# Altium schematic sheet Bop-It.SchDoc
size A
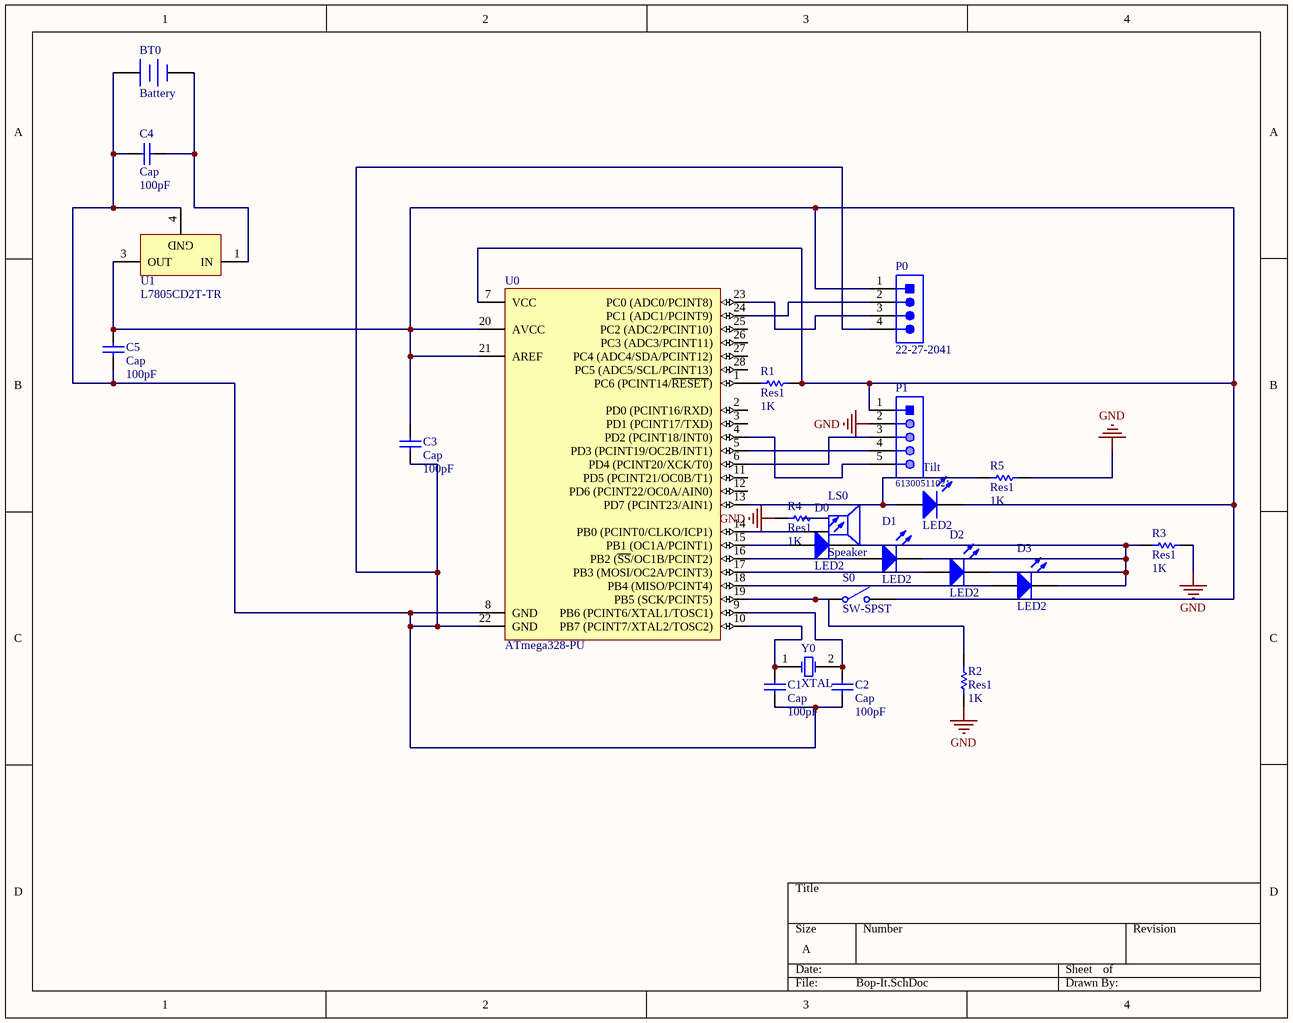
[diagram p0: Bop-It.SchDoc]

## Parts
BT0  Battery  [BAT-2]
C1  Cap  value 100pF  [RAD-0.3]
C2  Cap  value 100pF  [RAD-0.3]
C3  Cap  value 100pF  [RAD-0.3]
C4  Cap  value 100pF  [RAD-0.3]
C5  Cap  value 100pF  [RAD-0.3]
D0  LED2  [3.2X1.6X1.1]
D1  LED2  [3.2X1.6X1.1]
D2  LED2  [3.2X1.6X1.1]
D3  LED2  [3.2X1.6X1.1]
LS0  Speaker  [PIN2]
P0  22-27-2041  [MOLX-22-27-2041_V]
P1  61300511021  [61300511021]
R1  Res1  value 1K  [AXIAL-0.3]
R2  Res1  value 1K  [AXIAL-0.3]
R3  Res1  value 1K  [AXIAL-0.3]
R4  Res1  value 1K  [AXIAL-0.3]
R5  Res1  value 1K  [AXIAL-0.3]
S0  SW-SPST  [SPST-2]
Tilt  LED2  [3.2X1.6X1.1]
U0  ATmega328-PU  [28P3]
U1  L7805CD2T-TR  [TO-263_M]
Y0  XTAL  [R38]

## Nets
GND: P1.2 R2.1 R3.2 R4.1 R5.1
NetBT0_1: BT0.1(+) C1.2 C2.2 C3.2 C4.1 C5.2 P0.4 U0.8(GND) U0.22(GND) U1.4(GND)
NetBT0_2: BT0.2(-) C4.2 U1.1(IN)
NetC1_1: C1.1 U0.10(PB7_(PCINT7/XTAL2/TOSC2)) Y0.1(OSC1)
NetC2_1: C2.1 U0.9(PB6_(PCINT6/XTAL1/TOSC1)) Y0.2(OSC2)
NetC3_1: C3.1 C5.1 P0.1 P1.1 R1.2 S0.2(NO) Tilt.2(K) U0.7(VCC) U0.20(AVCC) U0.21(AREF) U1.3(OUT)
NetD0_1: D0.1(A) U0.15(PB1_(OC1A/PCINT1))
NetD0_2: D0.2(K) D1.2(K) D2.2(K) D3.2(K) R3.1
NetD1_1: D1.1(A) U0.16(PB2_(~{SS}/OC1B/PCINT2))
NetD2_1: D2.1(A) U0.17(PB3_(MOSI/OC2A/PCINT3))
NetD3_1: D3.1(A) U0.18(PB4_(MISO/PCINT4))
NetLS0_1: LS0.1 R4.2
NetLS0_2: LS0.2 U0.14(PB0_(PCINT0/CLKO/ICP1))
NetP0_2: P0.2 U0.24(PC1_(ADC1/PCINT9))
NetP0_3: P0.3 U0.23(PC0_(ADC0/PCINT8))
NetP1_3: P1.3 U0.6(PD4_(PCINT20/XCK/T0))
NetP1_4: P1.4 U0.5(PD3_(PCINT19/OC2B/INT1))
NetP1_5: P1.5 U0.4(PD2_(PCINT18/INT0))
NetR1_1: R1.1 U0.1(PC6_(PCINT14/~{RESET}))
NetR2_2: R2.2 S0.1(COMMON) U0.19(PB5_(SCK/PCINT5))
NetR5_2: R5.2 Tilt.1(A) U0.13(PD7_(PCINT23/AIN1))

Not connected (* = marked no-connect by the designer): U0 2(PD0_(PCINT16/RXD)) 3(PD1_(PCINT17/TXD)) 11(PD5_(PCINT21/OC0B/T1)) 12(PD6_(PCINT22/OC0A/AIN0)) 25(PC2_(ADC2/PCINT10)) 26(PC3_(ADC3/PCINT11)) 27(PC4_(ADC4/SDA/PCINT12)) 28(PC5_(ADC5/SCL/PCINT13))

## Library data of the parts
BT0 = Battery: Multicell Battery; Published: 24-Mar-1999; LatestRevisionDate: 17-Jul-2002; LatestRevisionNote: Re-released for DXP Platform.; PackageReference: BAT-2; Publisher: Altium Limited; PackageDescription: Battery; 2 Leads
C1-C5 = Cap: Capacitor; Published: 8-Jun-2000; LatestRevisionDate: 17-Jul-2002; LatestRevisionNote: Re-released for DXP Platform.; PackageReference: RAD-0.3; Publisher: Altium Limited; PackageDescription: Radial Cap, Thru-Hole; 2 Leads; 0.3 in Pin Spacing
D0-D3 Tilt = LED2: Typical RED, GREEN, YELLOW, AMBER GaAs LED; Published: 8-Jun-2000; LatestRevisionDate: 17-Jul-2002; LatestRevisionNote: Re-released for DXP Platform.; PackageVersion: Feb-2002; PackageReference: 3.2X1.6X1.1; Publisher: Altium Limited; PackageDescription: SM LED; 2 Flat Leads
LS0 = Speaker: Loudspeaker; Published: 24-Mar-1999; LatestRevisionDate: 17-Jul-2002; LatestRevisionNote: Re-released for DXP Platform.; PackageReference: PIN2; Publisher: Altium Limited
P0 = CMP-2000-05243-1: Male Header, Pitch 2.54 mm, 1 x 4 Position, Height 11.7 mm, Tail Length 3.56 mm, RoHS, Bulk; Manufacturer: Molex; Voltage rating: 250V; Current rating: 4A; Datasheet Version: Rev. F, 06/2009; Operating temperature: 0degCto+75degC; Contact material: Tinplatedbrass; Manufacturer URL: http://www.molex.com/; Housing material: Nylon(UL94V-0); Datasheet URL: http://www.molex.com/pdm_docs/sd/022272041_sd.pdf
P1 = CMP-1502-01067-1: THT Angled Pin Header WR-PHD, Pitch 2.54 mm, Single Row, 5 pins; Manufacturer: Wurth Elektronik; Working Voltage: 250VAC; Withstanding Voltage: 500VAC; Gender: Male; Contact Resistance: 20mOhm; Rated Current: 3A; Pitch: 2.54mm; Pin Number: 5; Orientation: Angled; Packaging: Bag; Package Reference: 61300511021; Mounting Technology: THT; Publisher: WurthElektronik; Row Number: Single; Operating Temperature: -40to105degC; Part Number: 61300511021; Datasheet URL: https://katalog.we-online.de/em/datasheet/6130xx11021.pdf; Manufacturer URL: http://www.we-online.de
R1-R5 = Res1: Resistor; Published: 8-Jun-2000; LatestRevisionDate: 17-Jul-2002; LatestRevisionNote: Re-released for DXP Platform.; PackageReference: AXIAL-0.3; Publisher: Altium Limited; PackageDescription: Axial Device, Thru-Hole; 2 Leads; 0.3 in Pin Spacing
S0 = SW-SPST: Single-Pole, Single-Throw Switch; Published: 24-Mar-1999; LatestRevisionDate: 17-Jul-2002; LatestRevisionNote: Re-released for DXP Platform.; PackageReference: SPST-2; Publisher: Altium Limited; PackageDescription: Switch; 2 Leads
U0 = CMP-0095-00015-2: 8-bit AVR Microcontroller, 32KB Flash, 1KB EEPROM, 2KB SRAM, 28-pin PDIP, Industrial Grade (-40°C to 85°C); ComponentLink3Description: ATmega48A/48PA/88A/88PA/168A/168PA/328/328P Summary; RevisionNote: DatasheetVersion updated. URLs added.; DatasheetVersion: revD, May-2011; ComponentLink1URL: http://www.atmel.com/; PackageVersion: revB, Sep-2001; PackageDescription: 28-lead (0.300"/7.62mm Wide) Plastic Dual Inline Package (PDIP); PackageReference: 28P3; ComponentLink1Description: Manufacturer URL; ComponentLink2Description: ATmega48A/48PA/88A/88PA/168A/168PA/328/328P Datasheet; ComponentLink3URL: http://www.atmel.com/dyn/resources/prod_documents/8271S.pdf; ComponentLink2URL: http://www.atmel.com/dyn/resources/prod_documents/8271.pdf
U1 = CMP-0244-00213-1: Positive Voltage Regulator, 3-Pin D2PAK, Tape and Reel; PackageReference: TO-263; ComponentLink2URL: http://www.st.com/internet/com/TECHNICAL_RESOURCES/TECHNICAL_LITERATURE/DATASHEET/CD00000444.pdf; PackageDescription: 3-Pin Transistor Outline Package 2.54 mm Pitch, 15.4 mm Lead Span (D2PAK); DatasheetVersion: 16/11/2011; ComponentLink2Description: Datasheet; ComponentLink1Description: Manufacturer URL; PackageVersion: 2011; ComponentLink1URL: http://www.st.com
Y0 = XTAL: Crystal Oscillator; Published: 8-Jun-2000; LatestRevisionDate: 17-Jul-2002; LatestRevisionNote: Re-released for DXP Platform.; PackageReference: R38; Publisher: Altium Limited; PackageDescription: Crystal, Thru-Hole; 2 Leads; Body 3.1 x 8.2 mm (Dia.xH)